# Altium schematic sheet BMD101circuits.SchDoc
size A4; SheetNumber: 1; SheetTotal: 1
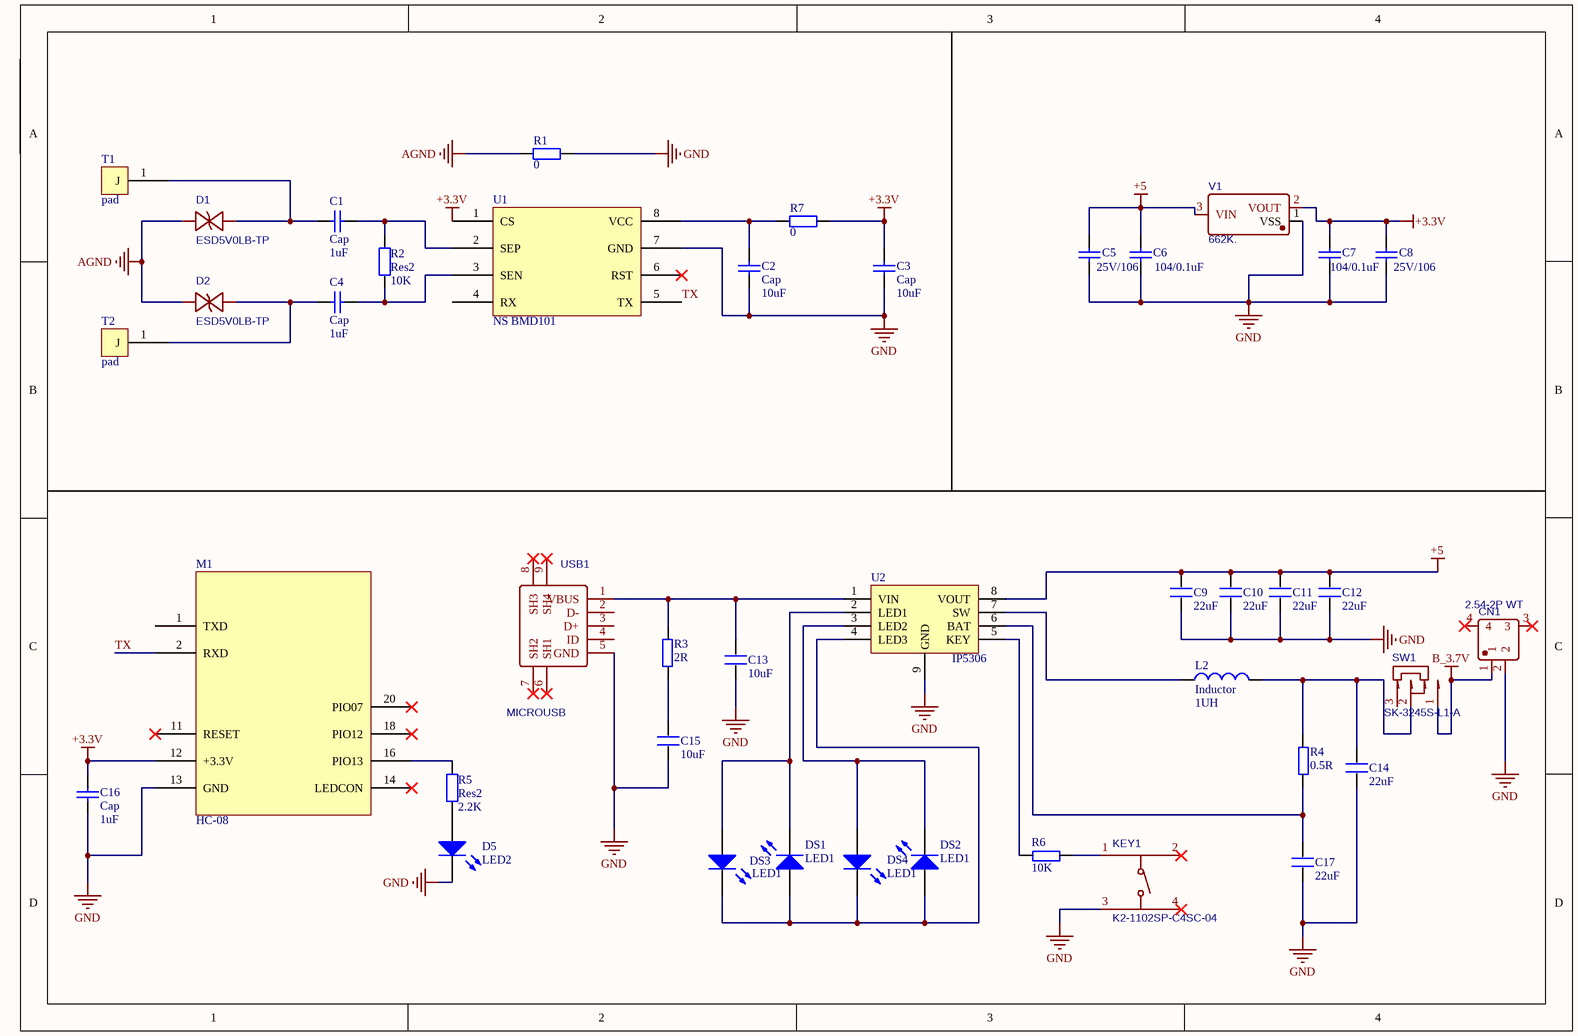
[diagram p0: BMD101circuits.SchDoc]

## Parts
C1  Cap  value 1uF  [J1-0603]
C2  Cap  value 10uF  [J1-0603]
C3  Cap  value 10uF  [J1-0603]
C4  Cap  value 1uF  [J1-0603]
C5  25V/106  [J1-0603]
C6  value 104/0.1uF  [J1-0603]  (hidden comment: 104)
C7  value 104/0.1uF  [J1-0603]  (hidden comment: 104)
C8  25V/106  [J1-0603]
C9  22uF  [J1-0603]
C10  22uF  [J1-0603]
C11  22uF  [J1-0603]
C12  22uF  [J1-0603]
C13  10uF  [J1-0603]
C14  22uF  [J1-0603]
C15  10uF  [J1-0603]
C16  Cap  value 1uF  [J1-0603]
C17  22uF  [J1-0603]
CN1  2.54-2P WT  [CONN-SMD_2.54-2PWT]
D1  ESD5V0LB-TP  [ESD5V0D5B]
D2  ESD5V0LB-TP  [ESD5V0D5B]
D5  LED2  [LED0603-FD]
DS1  LED1  [LED0603-FD]
DS2  LED1  [LED0603-FD]
DS3  LED1  [LED0603-FD]
DS4  LED1  [LED0603-FD]
KEY1  K2-1102SP-C4SC-04  [KEY-SMD_4P-L6.0-W6.0-P4.50-LS9.5-BL]
L2  Inductor  value 1UH  [J1-0603]
M1  HC-08  [HC-08]
R1  value 0  [J1-0603]  (hidden comment: 10K)
R2  Res2  value 10K  [J1-0603]
R3  2R  [J1-0603]
R4  0.5R  [J1-0603]
R5  Res2  value 2.2K  [J1-0603]
R6  10K  [J1-0603]
R7  value 0  [J1-0603]  (hidden comment: 10K)
SW1  SK-3245S-L1-A  [SW-SMD_SK-3245S-L1-A-1]
T1  pad  [BATOO]
T2  pad  [BATOO]
U1  NS BMD101  [BMD101]
U2  IP5306  [ip5306]
USB1  MICROUSB  [MICRO-USB-SMD_MICROXNJ]
V1  662K.  [662K]

## Nets
+3.3V: C3.2 C7.1 C8.2 C16.2 M1.12(+3.3V) R7.2 U1.1(CS) V1.2(VOUT)
+5: C5.2 C6.1 C9.2 C10.2 C11.2 C12.2 U2.8(VOUT) V1.3(VIN)
AGND: D1.1 D2.2 R1.1
B_3.7V: CN1.1 SW1.1
GND: C2.1 C3.1 C5.1 C6.2 C7.2 C8.1 C9.1 C10.1 C11.1 C12.1 C13.1 C14.1 C15.1 C16.1 C17.1 CN1.2 D5.2(K) KEY1.3 M1.13(GND) R1.2 U1.7(GND) U2.9(GND) USB1.5(GND) V1.1(VSS)
TX: M1.2(RXD) U1.5(TX)
NetC1_1: C1.1 D1.2 T1.1(J)
NetC1_2: C1.2 R2.2 U1.2(SEP)
NetC2_2: C2.2 R7.1 U1.8(VCC)
NetC4_1: C4.1 D2.1 T2.1(J)
NetC4_2: C4.2 R2.1 U1.3(SEN)
NetC13_2: C13.2 R3.1 U2.1(VIN) USB1.1(VBUS)
NetC14_2: C14.2 L2.2 R4.2 SW1.2
NetC15_2: C15.2 R3.2
NetC17_2: C17.2 R4.1 U2.6(BAT)
NetD5_1: D5.1(A) R5.1
NetDS1_1: DS1.1(A) DS2.1(A) DS3.2(K) DS4.2(K) U2.4(LED3)
NetDS1_2: DS1.2(K) DS3.1(A) U2.2(LED1)
NetDS2_2: DS2.2(K) DS4.1(A) U2.3(LED2)
NetKEY1_1: KEY1.1 R6.2
NetL2_1: L2.1 U2.7(SW)
NetM1_16: M1.16(PIO13) R5.2
NetR6_1: R6.1 U2.5(KEY)

Not connected (* = marked no-connect by the designer): CN1 3* 4*; KEY1 2* 4*; M1 1(TXD) 11(RESET)* 14(LEDCON)* 18(PIO12)* 20(PIO07)*; SW1 3; U1 4(RX) 6(RST)*; USB1 2(D-) 3(D+) 4(ID) 6(SH1)* 7(SH2)* 8(SH3)* 9(SH4)*

## Library data of the parts
C1-C4 C6 C7 C16 = Cap: Capacitor; Published: 8-Jun-2000; LatestRevisionDate: 17-Jul-2002; LatestRevisionNote: Re-released for DXP Platform.; PackageReference: RAD-0.3; Publisher: Altium Limited; PackageDescription: Radial Cap, Thru-Hole; 2 Leads; 0.3 in Pin Spacing
C5 C8 = Cap: Capacitor; Value: 106; Published: 8-Jun-2000; LatestRevisionDate: 17-Jul-2002; LatestRevisionNote: Re-released for DXP Platform.; PackageReference: RAD-0.3; Publisher: Altium Limited; PackageDescription: Radial Cap, Thru-Hole; 2 Leads; 0.3 in Pin Spacing
C9-C15 C17 = C_22: 0805
CN1 = 2.54-2P WT: BOM_Manufacturer: SHOU HAN; Contributor: LCSC; BOM_Supplier: LCSC; BOM_Supplier Part: C668622; BOM_Manufacturer Part: 2.54-2P WT; BOM_JLCPCB Part Class: Extended Part; spicePre: C; spiceSymbolName: 2.54-2P WT
D1 D2 = ESD5V0LB-TP: BOM_Manufacturer: MCC(Micro Commercial Components); Contributor: LCSC; BOM_Supplier: LCSC; BOM_Supplier Part: C668927; BOM_Manufacturer Part: ESD5V0LB-TP; BOM_JLCPCB Part Class: Extended Part; JLCPCB Part Class: Extended Part; spicePre: D; spiceSymbolName: ESD5V0LB-TP
D5 DS1-DS4 = LED2: Typical RED, GREEN, YELLOW, AMBER GaAs LED; Published: 8-Jun-2000; LatestRevisionDate: 17-Jul-2002; LatestRevisionNote: Re-released for DXP Platform.; PackageReference: 3.2X1.6X1.1; Publisher: Altium Limited
  D5: PackageVersion: Feb-2002; PackageDescription: SM LED; 2 Flat Leads
  DS1-DS4: PackageDocument: Feb-2002
KEY1 = K2-1102SP-C4SC-04: BOM_Manufacturer: HRO; Contributor: LCSC; BOM_Supplier: LCSC; BOM_Manufacturer Part: K2-1102SP-C4SC-04; BOM_Supplier Part: C127509; BOM_JLCPCB Part Class: Extended Part; spicePre: S; spiceSymbolName: K2-1102SP-C4SC-04
L2 = Inductor: Code_IEC: 1005; Published: 8-Jun-2000; LatestRevisionDate: 29-May-2009; LatestRevisionNote: IPC-7351 Footprint Added.; PackageReference: 0402-A; Publisher: Altium Limited; PackageDescription: Chip Inductor; Code_JEITA: 0402
M1 = HC-08: BLE蓝牙通信模块
R1 R2 R5 R7 = Res2: Resistor; Published: 8-Jun-2000; LatestRevisionDate: 17-Jul-2002; LatestRevisionNote: Re-released for DXP Platform.; PackageReference: AXIAL-0.4; Publisher: Altium Limited; PackageDescription: Axial Device, Thru-Hole; 2 Leads; 0.4 in Pin Spacing
R3 R4 R6 = R_2
SW1 = SK-3245S-L1-A: 卧式滑动开关; BOM_Manufacturer: XKB Enterprise; Contributor: LCSC; BOM_Supplier: LCSC; BOM_Supplier Part: C405951; BOM_Manufacturer Part: SK-3245S-L1-A; BOM_JLCPCB Part Class: Extended Part; spicePre: S; spiceSymbolName: SK-3245S-L1-A
T1 T2 = BATOO
U1 = BMD101: NeuroSky心率芯片
U2 = IP5306: SOP8
USB1 = MICROusb: BOM_Manufacturer: SHOU HAN; BOM_Manufacturer Part: MicroXNJ; Contributor: LCSC; BOM_Supplier: LCSC; BOM_Supplier Part: C404969; BOM_JLCPCB Part Class: Extended Part; spicePre: U; spiceSymbolName: MICROXNJ
V1 = 662K.: BOM_Manufacturer: Shenzhen Fuman Elec; Contributor: LCSC; BOM_Supplier: LCSC; BOM_Supplier Part: C841298; BOM_Manufacturer Part: 662K.; BOM_JLCPCB Part Class: Extended Part; spicePre: U; spiceSymbolName: 662K.